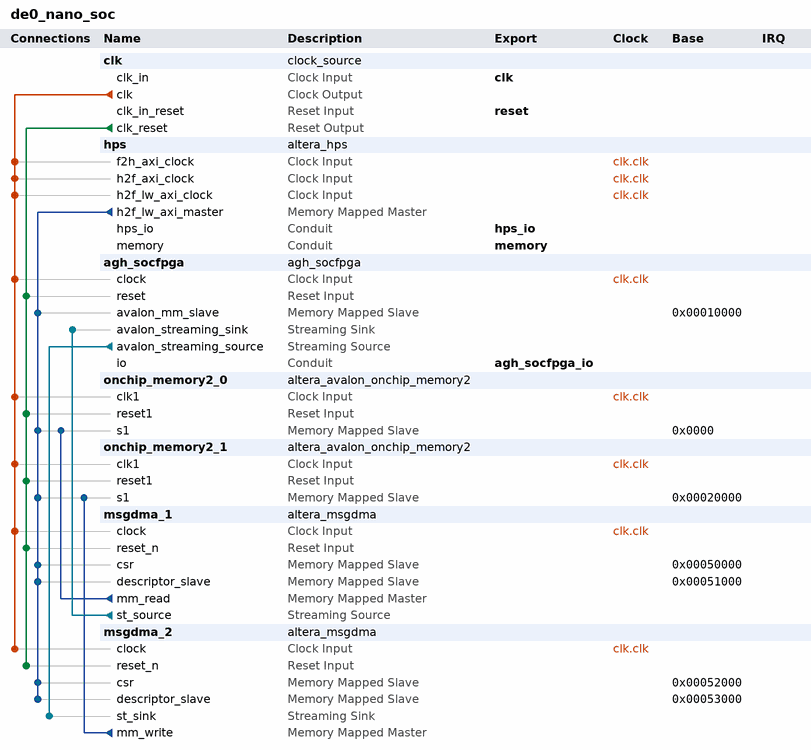
[diagram p0: system contents]
# Platform Designer (Qsys) system de0_nano_soc, Cyclone V 5CSEMA4U23C6
# Parameters at their usual value, and those the tool derives, are not listed.
package require -exact qsys 23.1
create_system de0_nano_soc
set_project_property DEVICE_FAMILY {Cyclone V}
set_project_property DEVICE 5CSEMA4U23C6

add_instance clk clock_source 23.1
set_instance_parameter_value clk clockFrequency 50000000

add_instance hps altera_hps 23.1
set_instance_parameter_value hps EMAC1_Mode RGMII
set_instance_parameter_value hps EMAC1_PinMuxing {HPS I/O Set 0}
set_instance_parameter_value hps F2SCLK_COLDRST_Enable false
set_instance_parameter_value hps F2SCLK_DBGRST_Enable false
set_instance_parameter_value hps F2SCLK_WARMRST_Enable false
set_instance_parameter_value hps F2SINTERRUPT_Enable false
set_instance_parameter_value hps F2S_Width 2
set_instance_parameter_value hps FPGA_PERIPHERAL_OUTPUT_CLOCK_FREQ_EMAC0_GTX_CLK 125
set_instance_parameter_value hps FPGA_PERIPHERAL_OUTPUT_CLOCK_FREQ_EMAC0_MD_CLK 2.5
set_instance_parameter_value hps FPGA_PERIPHERAL_OUTPUT_CLOCK_FREQ_EMAC1_GTX_CLK 125
set_instance_parameter_value hps FPGA_PERIPHERAL_OUTPUT_CLOCK_FREQ_EMAC1_MD_CLK 2.5
set_instance_parameter_value hps HPS_PROTOCOL DDR3
set_instance_parameter_value hps I2C0_Mode N/A
set_instance_parameter_value hps I2C0_PinMuxing Unused
set_instance_parameter_value hps I2C1_Mode N/A
set_instance_parameter_value hps I2C1_PinMuxing Unused
set_instance_parameter_value hps LWH2F_Enable true
set_instance_parameter_value hps MEM_BANKADDR_WIDTH 3
set_instance_parameter_value hps MEM_CLK_FREQ 400.0
set_instance_parameter_value hps MEM_COL_ADDR_WIDTH 10
set_instance_parameter_value hps MEM_DQ_WIDTH 32
set_instance_parameter_value hps MEM_DRV_STR RZQ/6
set_instance_parameter_value hps MEM_ROW_ADDR_WIDTH 15
set_instance_parameter_value hps MEM_RTT_NOM RZQ/6
set_instance_parameter_value hps MEM_RTT_WR {Dynamic ODT off}
set_instance_parameter_value hps MEM_TCL 7
set_instance_parameter_value hps MEM_TFAW_NS 37.5
set_instance_parameter_value hps MEM_TRAS_NS 35.0
set_instance_parameter_value hps MEM_TRCD_NS 13.75
set_instance_parameter_value hps MEM_TRFC_NS 300.0
set_instance_parameter_value hps MEM_TRP_NS 13.75
set_instance_parameter_value hps MEM_VENDOR Other
set_instance_parameter_value hps MEM_WTCL 7
set_instance_parameter_value hps QSPI_Mode N/A
set_instance_parameter_value hps QSPI_PinMuxing Unused
set_instance_parameter_value hps REF_CLK_FREQ 25.0
set_instance_parameter_value hps S2FCLK_USER2CLK 5
set_instance_parameter_value hps S2F_Width 2
set_instance_parameter_value hps SDIO_Mode {4-bit Data}
set_instance_parameter_value hps SDIO_PinMuxing {HPS I/O Set 0}
set_instance_parameter_value hps SPIM1_Mode N/A
set_instance_parameter_value hps SPIM1_PinMuxing Unused
set_instance_parameter_value hps STM_Enable false
set_instance_parameter_value hps TIMING_BOARD_AC_SKEW 0.02
set_instance_parameter_value hps TIMING_BOARD_AC_TO_CK_SKEW 0.0
set_instance_parameter_value hps TIMING_BOARD_DQ_TO_DQS_SKEW 0.0
set_instance_parameter_value hps TIMING_BOARD_MAX_CK_DELAY 0.6
set_instance_parameter_value hps TIMING_BOARD_MAX_DQS_DELAY 0.6
set_instance_parameter_value hps TIMING_BOARD_SKEW_BETWEEN_DQS 0.02
set_instance_parameter_value hps TIMING_BOARD_SKEW_CKDQS_DIMM_MAX 0.01
set_instance_parameter_value hps TIMING_BOARD_SKEW_CKDQS_DIMM_MIN -0.01
set_instance_parameter_value hps TIMING_BOARD_SKEW_WITHIN_DQS 0.02
set_instance_parameter_value hps TIMING_TDH 125
set_instance_parameter_value hps TIMING_TDQSCK 400
set_instance_parameter_value hps TIMING_TDQSQ 120
set_instance_parameter_value hps TIMING_TDS 50
set_instance_parameter_value hps TIMING_TIH 250
set_instance_parameter_value hps TIMING_TIS 175
set_instance_parameter_value hps TIMING_TQSH 0.38
set_instance_parameter_value hps UART0_Mode {No Flow Control}
set_instance_parameter_value hps UART0_PinMuxing {HPS I/O Set 0}
set_instance_parameter_value hps USB1_Mode SDR
set_instance_parameter_value hps USB1_PinMuxing {HPS I/O Set 0}
set_instance_parameter_value hps desired_cfg_clk_mhz 100.0
set_instance_parameter_value hps desired_qspi_clk_mhz 400.0

add_instance agh_socfpga agh_socfpga 1.0

add_instance onchip_memory2_0 altera_avalon_onchip_memory2 23.1
set_instance_parameter_value onchip_memory2_0 dataWidth 32
set_instance_parameter_value onchip_memory2_0 dualPort false
set_instance_parameter_value onchip_memory2_0 initMemContent false
set_instance_parameter_value onchip_memory2_0 initializationFileName onchip_mem.hex
set_instance_parameter_value onchip_memory2_0 memorySize 65536

add_instance onchip_memory2_1 altera_avalon_onchip_memory2 23.1
set_instance_parameter_value onchip_memory2_1 dataWidth 32
set_instance_parameter_value onchip_memory2_1 dualPort false
set_instance_parameter_value onchip_memory2_1 initMemContent false
set_instance_parameter_value onchip_memory2_1 initializationFileName onchip_mem.hex
set_instance_parameter_value onchip_memory2_1 memorySize 65536

add_instance msgdma_1 altera_msgdma 23.1
set_instance_parameter_value msgdma_1 BURST_ENABLE 0
set_instance_parameter_value msgdma_1 DATA_FIFO_DEPTH 2048
set_instance_parameter_value msgdma_1 DATA_WIDTH 32
set_instance_parameter_value msgdma_1 DESCRIPTOR_FIFO_DEPTH 128
set_instance_parameter_value msgdma_1 ENHANCED_FEATURES 0
set_instance_parameter_value msgdma_1 ERROR_ENABLE 0
set_instance_parameter_value msgdma_1 MAX_BURST_COUNT 512
set_instance_parameter_value msgdma_1 MAX_BYTE 65536
set_instance_parameter_value msgdma_1 MODE 1
set_instance_parameter_value msgdma_1 PACKET_ENABLE 1
set_instance_parameter_value msgdma_1 TRANSFER_TYPE {Aligned Accesses}

add_instance msgdma_2 altera_msgdma 23.1
set_instance_parameter_value msgdma_2 BURST_ENABLE 0
set_instance_parameter_value msgdma_2 DATA_FIFO_DEPTH 2048
set_instance_parameter_value msgdma_2 DATA_WIDTH 32
set_instance_parameter_value msgdma_2 DESCRIPTOR_FIFO_DEPTH 128
set_instance_parameter_value msgdma_2 ENHANCED_FEATURES 0
set_instance_parameter_value msgdma_2 ERROR_ENABLE 0
set_instance_parameter_value msgdma_2 MAX_BURST_COUNT 512
set_instance_parameter_value msgdma_2 MAX_BYTE 65536
set_instance_parameter_value msgdma_2 MODE 2
set_instance_parameter_value msgdma_2 PACKET_ENABLE 1
set_instance_parameter_value msgdma_2 TRANSFER_TYPE {Aligned Accesses}

# connections
add_connection clk.clk agh_socfpga.clock clock
add_connection clk.clk hps.f2h_axi_clock clock
add_connection clk.clk hps.h2f_axi_clock clock
add_connection clk.clk hps.h2f_lw_axi_clock clock
add_connection clk.clk msgdma_1.clock clock
add_connection clk.clk msgdma_2.clock clock
add_connection clk.clk onchip_memory2_0.clk1 clock
add_connection clk.clk onchip_memory2_1.clk1 clock
add_connection clk.clk_reset agh_socfpga.reset reset
add_connection clk.clk_reset msgdma_1.reset_n reset
add_connection clk.clk_reset msgdma_2.reset_n reset
add_connection clk.clk_reset onchip_memory2_0.reset1 reset
add_connection clk.clk_reset onchip_memory2_1.reset1 reset
add_connection hps.h2f_lw_axi_master agh_socfpga.avalon_mm_slave avalon
set_connection_parameter_value hps.h2f_lw_axi_master/agh_socfpga.avalon_mm_slave baseAddress 0x00010000
add_connection hps.h2f_lw_axi_master msgdma_1.csr avalon
set_connection_parameter_value hps.h2f_lw_axi_master/msgdma_1.csr baseAddress 0x00050000
add_connection hps.h2f_lw_axi_master msgdma_1.descriptor_slave avalon
set_connection_parameter_value hps.h2f_lw_axi_master/msgdma_1.descriptor_slave baseAddress 0x00051000
add_connection hps.h2f_lw_axi_master msgdma_2.csr avalon
set_connection_parameter_value hps.h2f_lw_axi_master/msgdma_2.csr baseAddress 0x00052000
add_connection hps.h2f_lw_axi_master msgdma_2.descriptor_slave avalon
set_connection_parameter_value hps.h2f_lw_axi_master/msgdma_2.descriptor_slave baseAddress 0x00053000
add_connection hps.h2f_lw_axi_master onchip_memory2_0.s1 avalon
set_connection_parameter_value hps.h2f_lw_axi_master/onchip_memory2_0.s1 baseAddress 0x0000
add_connection hps.h2f_lw_axi_master onchip_memory2_1.s1 avalon
set_connection_parameter_value hps.h2f_lw_axi_master/onchip_memory2_1.s1 baseAddress 0x00020000
add_connection msgdma_1.mm_read onchip_memory2_0.s1 avalon
set_connection_parameter_value msgdma_1.mm_read/onchip_memory2_0.s1 baseAddress 0x0000
add_connection msgdma_2.mm_write onchip_memory2_1.s1 avalon
set_connection_parameter_value msgdma_2.mm_write/onchip_memory2_1.s1 baseAddress 0x00020000
add_connection agh_socfpga.avalon_streaming_source msgdma_2.st_sink avalon_streaming
add_connection msgdma_1.st_source agh_socfpga.avalon_streaming_sink avalon_streaming

# exported interfaces
add_interface agh_socfpga_io conduit end
set_interface_property agh_socfpga_io EXPORT_OF agh_socfpga.io
add_interface clk clock sink
set_interface_property clk EXPORT_OF clk.clk_in
add_interface hps_io conduit end
set_interface_property hps_io EXPORT_OF hps.hps_io
add_interface memory conduit end
set_interface_property memory EXPORT_OF hps.memory
add_interface reset reset sink
set_interface_property reset EXPORT_OF clk.clk_in_reset

set_interconnect_requirement {$system} qsys_mm.clockCrossingAdapter HANDSHAKE
set_interconnect_requirement {$system} qsys_mm.enableEccProtection FALSE
set_interconnect_requirement {$system} qsys_mm.insertDefaultSlave FALSE
set_interconnect_requirement {$system} qsys_mm.maxAdditionalLatency 1

save_system de0_nano_soc.qsys
